# EAGLE board EDCPSUMK1-RP2040-USBC (EAGLE 9.6.2), part 1 of 2
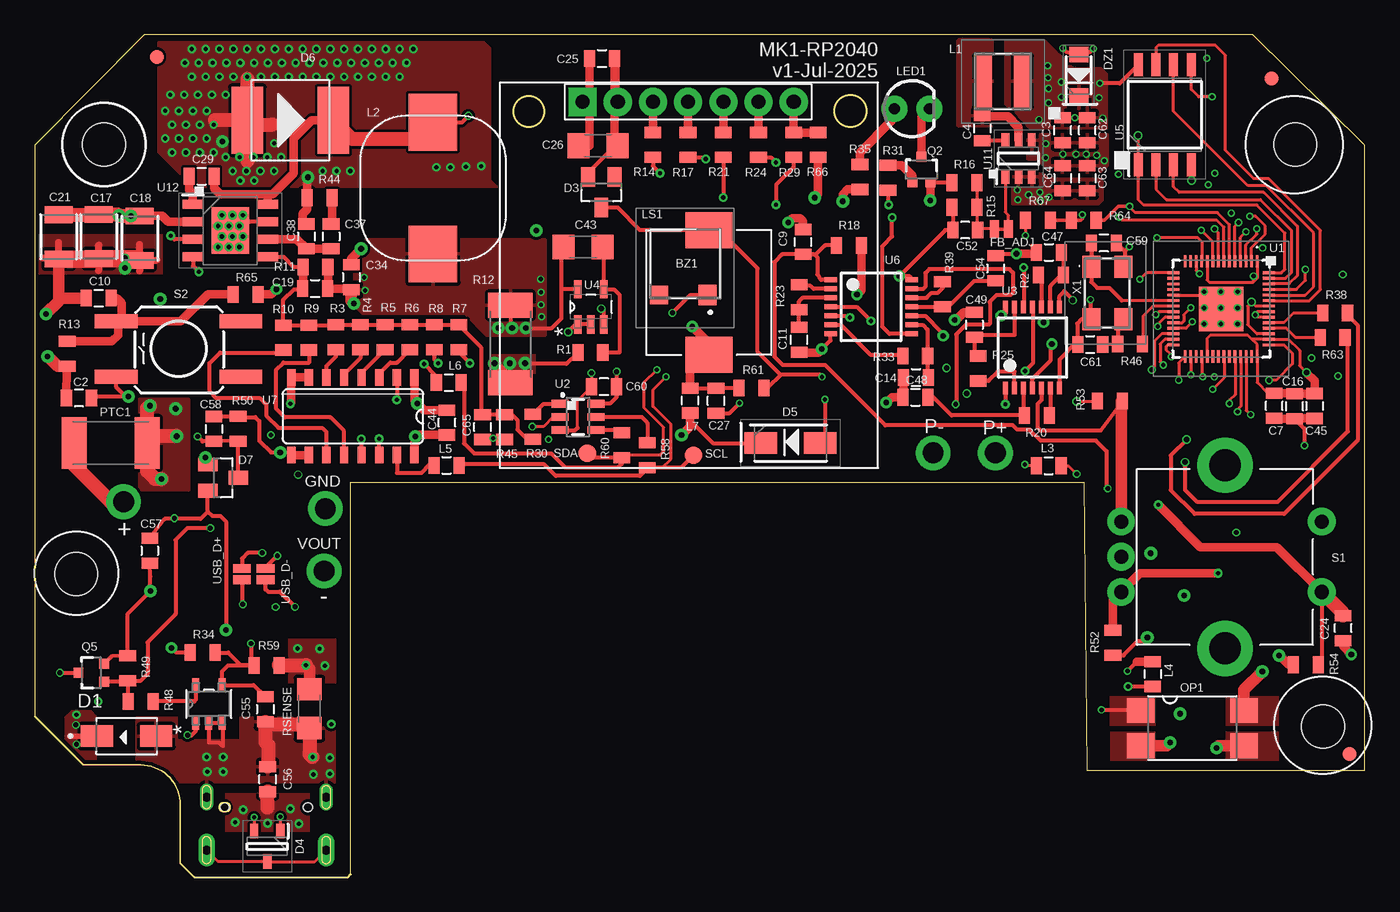
[diagram p2: board, top side]
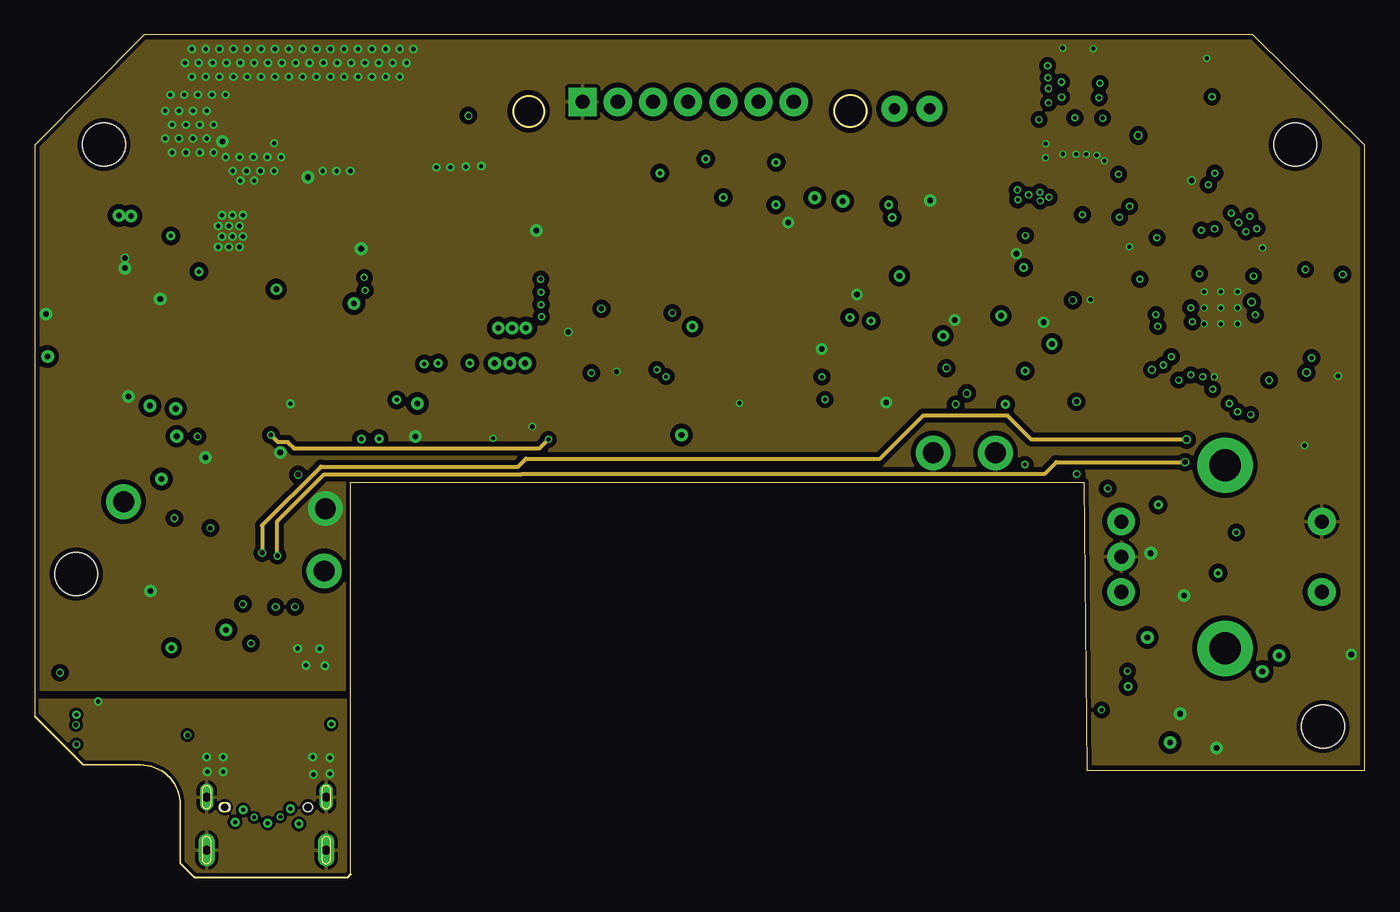
[diagram p3: board, inner layer GND]
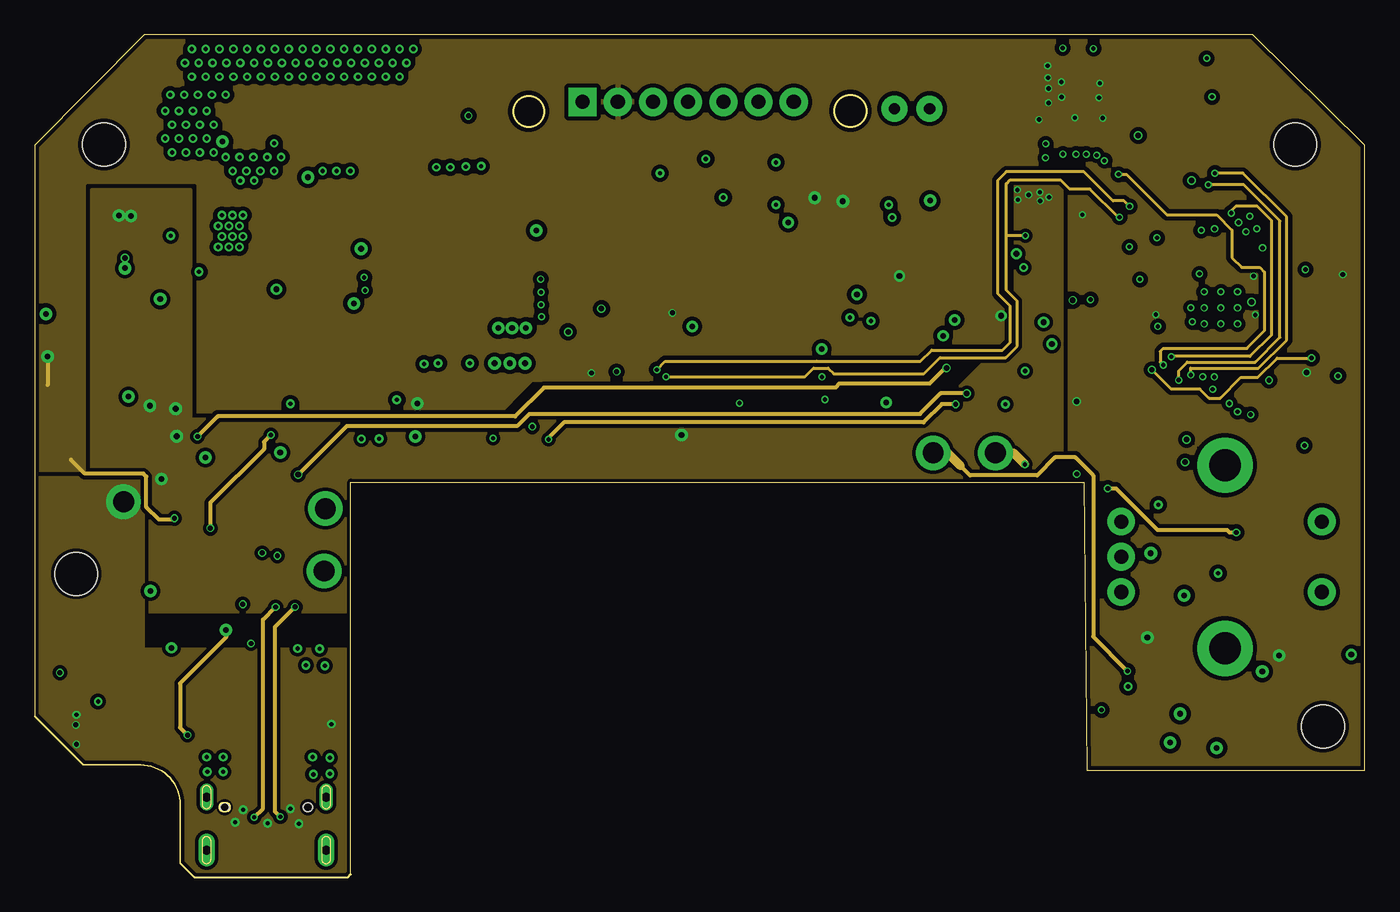
[diagram p4: board, inner layer PWR]
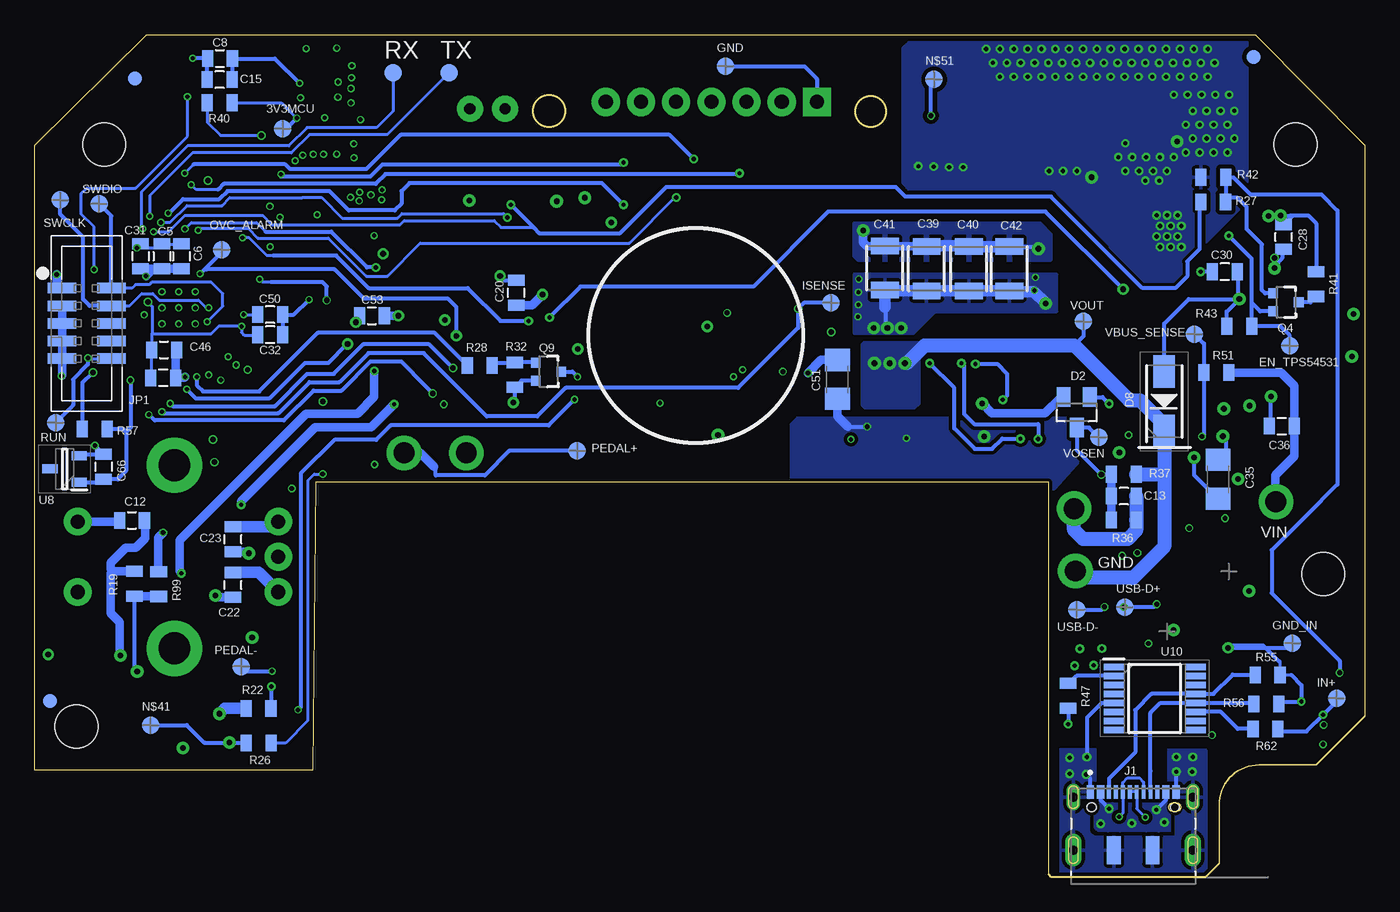
[diagram p5: board, bottom side, seen from below]

Size 96 x 60.8 mm. Coordinates in mm from the lower left corner, seen from the top.
Outline: 96,7.7 96,52.8 87.9,60.8 7.9,60.8 0,52.8 0,11.6 3.5,8.1 7.62,8.1 arc-90 10.5,5.22 10.5,1 11.5,0 22.6,0 22.8,0.2 22.8,28.5 75.71,28.5 75.92,7.7 96,7.7
Outline: circle at 35.64,55.26 radius 1.09
Outline: circle at 58.87,55.29 radius 1.14
Copper layers (1*2*15*16): Top 0.035mm / dielectric 0.2mm / GND 0.0175mm / dielectric 0.3mm / PWR 0.0175mm / dielectric 0.2mm / Bottom 0.035mm
Design rules "SeeedStudio_4layer_DRU_no_angle_20140221 *": minimum track width 8mil, minimum drill 12mil, track to track 8mil, track to pad 8mil, pad to pad 8mil, via to via 8mil, smd to smd 0mil, copper to edge 10mil, drill to drill 8mil, minimum pad ring 6mil, minimum via ring 4mil, stop-mask expansion 4mil, vias tented up to drill 25mil, thermal gap 10mil
Net classes: 1 vcc: width 0.254 mm
Holes 3.1 mm at 4.98,52.88 90.98,52.88 2.98,21.88 92.98,10.88
tRestrict: area 0.4,19.3 to 5.4,24.3; area 2.5,50.4 to 7.5,55.4; area 88.5,50.4 to 93.5,55.4; area 90.5,8.4 to 95.5,13.4
bRestrict: area 90.5,8.4 to 95.5,13.4; area 88.5,50.4 to 93.5,55.4; area 2.5,50.4 to 7.5,55.4; area 0.4,19.4 to 5.4,24.4

## Footprints (pad centres in the part's own frame; a part is rotated, then mirrored left to right if it is on the bottom)
TESTPAD_B1,27 = smd 1.27 x 1.27: TP 0,0
PKMCS0909 = smd 2.6 x 3.4: 1 -4.5,0; 2 4.5,0
0805 = smd 0.8 x 1.2: 1 -0.9,0; 2 0.9,0
1210 = smd 1.2 x 2: 1 -1.6,0; 2 1.6,0
1206 = smd 1.6 x 1.8: 1 -1.4,0; 2 1.4,0
DIOM4325X244N = smd 2.33 x 1.55: A 2.135,0; C -2.135,0
SOT23 = smd 1 x 1.4: 1 -0.95,-1.1; 2 0.95,-1.1; 3 0,1.1
SOT95P230X110-3N = smd 1.05 x 0.6: 1 -1.1,0.95; 2 -1.1,-0.95; 3 1.1,0
DIOM5226X244N = smd 2.35 x 1.55: 1 -2.15,0; 2 2.15,0
DO-214AB = smd 2.286 x 4.8: 1 -3.1,0; 2 3.1,0
SODFL3518X115N = smd 1.12 x 1.37: 1 -1.5,0; 2 1.5,0
SMT-JUMPER_2_NC_TRACE_NO-SILK = smd 0.635 x 1.27: 1 -0.508,0; 2 0.508,0
FIDUCIAL-1X2 = smd 1 x 1: 1 0,0
JAE_DX07S016JA1R1500 = smd 0.52 x 1: 1 -3.1,1.1; 2 -2.35,1.1; 11 2.35,1.1; 12 3.1,1.1 | smd 0.27 x 1: 3 -1.75,1.1; 4 -1.25,1.1; 5 -0.75,1.1; 6 -0.25,1.1; 7 0.25,1.1; 8 0.75,1.1; 9 1.25,1.1; 10 1.75,1.1 | smd 1 x 2: S1 -1.4,-3.1; S2 1.4,-3.1 | drill 0.65 long: S3 -4.32,0.725; S4 4.32,0.725 | drill 0.65 pad 1.2 long: S5 -4.32,-3.1; S6 4.32,-3.1 | hole 0.6: 3,0 | hole 0.63: 3,0; -3,0
OLED_LCD = drill 1.016 pad 2.032 square: 1 -7.42,13.7 | drill 1.016 pad 2.032: 2 -4.88,13.7; 3 -2.34,13.7; 4 0.2,13.7; 5 2.74,13.7; 6 5.28,13.7; 7 7.82,13.7
20021521-00010T1LF = smd 0.76 x 2.05: 1 -2.54,-1.78; 2 -2.54,1.78; 3 -1.27,-1.78; 4 -1.27,1.78; 5 0,-1.78; 6 0,1.78; 7 1.27,-1.78; 8 1.27,1.78; 9 2.54,-1.78; 10 2.54,1.78
NRS4018T100MDGJ = smd 1.2 x 3.7: 1 -1.4,0; 2 1.4,0
WE-LHMI = smd 4.1 x 3.5: 1 -4.75,0; 2 4.75,0
LED3MM = drill 0.813 pad 1.88: A -1.27,0; K 1.27,0
SMT0540SR = smd 1.5 x 1.3: 1 -2.25,-1.6; 2 2.25,-1.6 | smd 1.3 x 1.3: 3 -2.25,1.9
SMD4 = smd 1.78 x 2: 1 -1.27,-3.725; 2 1.27,-3.725; 3 1.27,3.725; 4 -1.27,3.725
1812L = smd 1.8 x 3.7: 1 -2.6,0; 2 2.65,0
SOT323 = smd 0.7 x 0.7: 1 -0.65,-0.925; 2 0.65,-0.925; 3 0,0.925
R2512 = smd 1.8 x 3.2: 1 -2.8,0; 2 2.8,0
ROTARY_ENC_PLAIN = drill 1.016 pad 2: A 7.493,-2.54; B 7.493,2.54; C 7.493,0; SW+ -6.985,2.54; SW- -6.985,-2.54 | drill 2.286 pad 4: P$3 0,6.604; P$4 0,-6.604
TAC_SW_SMD_KSC931G = smd 3.1 x 1: 1 -4.5,2; 2 4.5,2; 3 -4.5,-2; 4 4.5,-2
RP2040TR7 = smd 0.875 x 0.2: 1 -3.438,2.6; 2 -3.438,2.2; 3 -3.438,1.8; 4 -3.438,1.4; 5 -3.438,1; 6 -3.438,0.6; 7 -3.438,0.2; 8 -3.438,-0.2; 9 -3.438,-0.6; 10 -3.438,-1; 11 -3.438,-1.4; 12 -3.438,-1.8; 13 -3.438,-2.2; 14 -3.438,-2.6; 29 3.438,-2.6; 30 3.438,-2.2; 31 3.438,-1.8; 32 3.438,-1.4; 33 3.438,-1; 34 3.438,-0.6; 35 3.438,-0.2; 36 3.438,0.2; 37 3.438,0.6; 38 3.438,1; 39 3.438,1.4; 40 3.438,1.8; 41 3.438,2.2; 42 3.438,2.6 | smd 0.2 x 0.875: 15 -2.6,-3.438; 16 -2.2,-3.438; 17 -1.8,-3.438; 18 -1.4,-3.438; 19 -1,-3.438; 20 -0.6,-3.438; 21 -0.2,-3.438; 22 0.2,-3.438; 23 0.6,-3.438; 24 1,-3.438; 25 1.4,-3.438; 26 1.8,-3.438; 27 2.2,-3.438; 28 2.6,-3.438; 43 2.6,3.438; 44 2.2,3.438; 45 1.8,3.438; 46 1.4,3.438; 47 1,3.438; 48 0.6,3.438; 49 0.2,3.438; 50 -0.2,3.438; 51 -0.6,3.438; 52 -1,3.438; 53 -1.4,3.438; 54 -1.8,3.438; 55 -2.2,3.438; 56 -2.6,3.438 | smd 3.2 x 3.2: 57 0,0
SOT23-6 = smd 0.55 x 1.2: 1 0.95,1.3; 2 0,1.3; 3 -0.95,1.3; 4 -0.95,-1.3; 5 0,-1.3; 6 0.95,-1.3
TSSOP14 = smd 0.35 x 0.9: 1 -1.95,-2.925; 2 -1.3,-2.925; 3 -0.65,-2.925; 4 0,-2.925; 5 0.65,-2.925; 6 1.3,-2.925; 7 1.95,-2.925; 8 1.95,2.925; 9 1.3,2.925; 10 0.65,2.925; 11 0,2.925; 12 -0.65,2.925; 13 -1.3,2.925; 14 -1.95,2.925
SOT95P280X145-5N = smd 1.321 x 0.559: 1 -1.27,0.94; 2 -1.27,0; 3 -1.27,-0.94; 4 1.27,-0.94; 5 1.27,0.94
SOIC127P790X216-8N = smd 1.65 x 0.65: 1 -3.6,1.905; 2 -3.6,0.635; 3 -3.6,-0.635; 4 -3.6,-1.905; 5 3.6,-1.905; 6 3.6,-0.635; 7 3.6,0.635; 8 3.6,1.905
SO16 = smd 0.6 x 1.2: 1 -4.445,-2.8; 2 -3.175,-2.8; 3 -1.905,-2.8; 4 -0.635,-2.8; 5 0.635,-2.8; 6 1.905,-2.8; 7 3.175,-2.8; 8 4.445,-2.8; 9 4.445,2.8; 10 3.175,2.8; 11 1.905,2.8; 12 0.635,2.8; 13 -0.635,2.8; 14 -1.905,2.8; 15 -3.175,2.8; 16 -4.445,2.8
SOT96P240X120-3N = smd 1.1 x 0.65: 1 -1.05,0.96; 2 -1.05,-0.96; 3 1.05,0
21-0057F_MXM = smd 0.978 x 0.508: 1 -1.365,0.95; 2 -1.365,0; 3 -1.365,-0.95; 4 1.365,-0.95; 5 1.365,0.95
SOP65P640X120-16N = smd 1.475 x 0.45: 1 -2.938,2.275; 2 -2.938,1.625; 3 -2.938,0.975; 4 -2.938,0.325; 5 -2.938,-0.325; 6 -2.938,-0.975; 7 -2.938,-1.625; 8 -2.938,-2.275; 9 2.938,-2.275; 10 2.938,-1.625; 11 2.938,-0.975; 12 2.938,-0.325; 13 2.938,0.325; 14 2.938,0.975; 15 2.938,1.625; 16 2.938,2.275
SOT95P280X100-6N = smd 1.05 x 0.55: 1 -1.3,0.95; 2 -1.3,0; 3 -1.3,-0.95; 4 1.3,-0.95; 5 1.3,0; 6 1.3,0.95
SOIC127P600X163-9N = smd 1.5 x 0.65: 1 -2.7,1.905; 2 -2.7,0.635; 3 -2.7,-0.635; 4 -2.7,-1.905; 5 2.7,-1.905; 6 2.7,-0.635; 7 2.7,0.635; 8 2.7,1.905 | smd 2.71 x 3.35: 9 0,0
SMT-JUMPER_2_NO_NO-SILK = smd 0.635 x 1.27: 1 -0.406,0; 2 0.406,0
ABM3C16000MHZD4YT = smd 1.6 x 1.3: 1 -1.9,-1.15; 2 1.9,-1.15; 3 1.9,1.15; 4 -1.9,1.15

## Placement (x,y rotation side)
3V3MCU  TESTPAD_TPSQB1,27  [TESTPAD_B1,27]  78.11,54.02 0 bottom
BZ1  PKMCS0909E4000-R1  [PKMCS0909]  48.64,42.2 90 top
C2  100n 50v X7R/X5R  [0805]  3.18,34.58 180 top
C3  22uF 10V X5R  [0805]  74.18,53.9 90 top
C4  100n 50v X7R/X5R  [0805]  68.38,54.03 270 top
C5  100n 50v X7R/X5R  [0805]  86.81,44.8 270 bottom
C6  100n 50v X7R/X5R  [0805]  85.4,44.8 270 bottom
C7  100n 50v X7R/X5R  [0805]  89.45,34.01 90 top
C8  100n 50v X7R/X5R  [0805]  82.62,59.08 0 bottom
C9  1uF 50V X7R  [0805]  55.45,45.84 90 top
C10  100n 50v X7R/X5R  [0805]  4.61,41.78 0 top
C11  1uF 50V X7R  [0805]  55.16,38.79 90 top
C12  100n 50v X7R/X5R  [0805]  88.97,25.75 0 bottom
C13  1uF 50V X7R  [0805]  17.38,27.5 180 bottom
C14  100n 50v X7R/X5R  [0805]  63.6,36.06 0 top
C15  1uF 50V X7R  [0805]  82.65,57.55 180 bottom
C16  100n 50v X7R/X5R  [0805]  90.92,33.99 90 top
C17  4.7uF 50V X7R  [1210]  4.6,46.23 270 top
C18  4.7uF 50V X7R  [1210]  7.56,46.11 270 top
C19  N.C.  [0805]  20.22,42.47 0 top
C20  100n 50v X7R/X5R  [0805]  61.23,42.17 90 bottom
C21  4.7uF 50V X7R  [1210]  1.71,46.2 270 top
C22  100n 50v X7R/X5R  [0805]  81.69,21.09 90 bottom
C23  100n 50v X7R/X5R  [0805]  81.69,24.39 90 bottom
C24  100n 50v X7R/X5R  [0805]  94.44,17.98 90 top
C25  100n 50v X7R/X5R  [0805]  40.93,59.08 0 top
C26  10uF 50V X5R/X7R  [1206]  40.64,52.79 180 top
C27  100n 50v X7R/X5R  [0805]  49.16,34.38 90 top
C28  100n 50v X7R/X5R  [0805]  5.84,46.2 90 bottom
C29  100n 50v X7R/X5R  [0805]  12.03,50.58 0 top
C30  33n  [0805]  10.08,43.69 180 bottom
C31  100n 50v X7R/X5R  [0805]  88.35,44.8 270 bottom
C32  100n 50v X7R/X5R  [0805]  78.99,39.14 180 bottom
C33  100n 50v X7R/X5R  [0805]  86.73,36.03 180 bottom
C34  100n 50v X7R/X5R  [0805]  22.84,43.29 270 top
C35  10uF 50V X5R/X7R  [1206]  10.57,28.71 270 bottom
C36  100n 50v X7R/X5R  [0805]  5.98,32.55 0 bottom
C37  10nF  [0805]  21.38,46.23 270 top
C38  16pF  [0805]  19.59,46.23 270 top
C39  22uF 25V X5R  [1210]  31.61,43.91 90 bottom
C40  22uF 25V X5R  [1210]  28.56,43.91 90 bottom
C41  22uF 25V X5R  [1210]  34.62,43.96 90 bottom
C42  22uF 25V X5R  [1210]  25.64,43.91 90 bottom
C43  10uF 50V X5R/X7R  [1206]  39.56,45.47 0 top
C44  100n 50v X7R/X5R  [0805]  29.75,32.81 90 top
C45  1uF 50V X7R  [0805]  92.37,34 270 top
C46  1uF 50V X7R  [0805]  86.66,38.05 0 bottom
C47  100n 50v X7R/X5R  [0805]  73.2,45.09 0 top
C48  100n 50v X7R/X5R  [0805]  63.56,34.63 0 top
C49  100n 50v X7R/X5R  [0805]  67.82,39.86 270 top
C50  100n 50v X7R/X5R  [0805]  79.01,40.59 180 bottom
C51  10uF 50V X5R/X7R  [1206]  38.06,35.92 90 bottom
C52  N.C  [0805]  67.15,46.69 180 top
C53  100n 50v X7R/X5R  [0805]  71.65,40.52 0 bottom
C54  1uF 50V X7R  [0805]  69.35,43.93 270 top
C55  100n 50v X7R/X5R  [0805]  16.63,12.11 270 top
C56  1uF 50V X7R  [0805]  16.8,7.07 90 top
C57  100n 50v X7R/X5R  [0805]  8.29,23.55 270 top
C58  100n 50v X7R/X5R  [0805]  12.93,32.34 270 top
C59  27p  [0805]  77.16,45.76 180 top
C60  100n 50v X7R/X5R  [0805]  41.07,35.39 180 top
C61  27p  [0805]  76.17,38.44 0 top
C62  22uF 10V X5R  [0805]  75.96,53.9 90 top
C63  4.7uF 50V X5R  [0805]  75.96,50.43 270 top
C64  4.7uF 50V X5R  [0805]  74.18,50.44 270 top
C65  N.C.  [0805]  32.31,32.48 90 top
C66  100n 50v X7R/X5R  [0805]  91.02,29.61 270 bottom
D1  SMAJ24A  [DIOM4325X244N]  6.62,10.18 0 top
D2  BAV199  [SOT23]  20.77,33.54 180 bottom
D3  N.C  [SOT23]  40.88,49.43 180 top
D4  PESD5V0U2BT,215  [SOT95P230X110-3N]  16.77,2.22 270 top
D5  3SMAJ5923B-TP  [DIOM5226X244N]  54.54,31.32 0 top
D6  N.C  [DO-214AB]  18.43,54.62 0 top
D7  BAV199  [SOT23]  13.59,28.83 270 top
D8  RB060M-60TR  [DIOM5226X244N]  14.46,34.33 90 bottom
DZ1  MMSZ5228B-7-F  [SODFL3518X115N]  75.34,57.86 90 top
EN_TPS54531  TESTPAD_TPSQB1,27  [TESTPAD_B1,27]  5.41,38.35 0 bottom
FB_ADJ  JUMPER-SMT_2_NC_TRACE_NO-SILK  [SMT-JUMPER_2_NC_TRACE_NO-SILK]  69.77,46.77 0 top
FID1  FIDUCIAL1X2  [FIDUCIAL-1X2]  89.27,57.64 0 top
FID2  FIDUCIAL1X2  [FIDUCIAL-1X2]  94.9,8.89 0 top
FID3  FIDUCIAL1X2  [FIDUCIAL-1X2]  8.03,59.19 0 bottom
FID4  FIDUCIAL1X2  [FIDUCIAL-1X2]  8.79,59.19 0 top
FID5  FIDUCIAL1X2  [FIDUCIAL-1X2]  88.76,57.64 0 bottom
FID6  FIDUCIAL1X2  [FIDUCIAL-1X2]  94.9,12.7 0 bottom
GND  TESTPAD_TPSQB1,27  [TESTPAD_B1,27]  46.12,58.5 0 bottom
GND_IN  TESTPAD_TPSQB1,27  [TESTPAD_B1,27]  5.21,16.89 0 bottom
IN+  TESTPAD_TPSQB1,27  [TESTPAD_B1,27]  2.02,12.91 0 bottom
ISENSE  TESTPAD_TPSQB1,27  [TESTPAD_B1,27]  38.53,41.44 0 bottom
J1  DX07S016JA1R1500  [JAE_DX07S016JA1R1500]  16.7,5.05 0 bottom
J6  Display  [OLED_LCD]  46.95,42.24 0 top
JP1  20021521-00010T1LF  [20021521-00010T1LF]  92.24,39.96 270 bottom
L1  NRS4018T4R7MDGJ  [NRS4018T100MDGJ]  69.87,57.42 0 top
L2  4.7uH  [WE-LHMI]  28.73,49.72 270 top
L3  MMZ2012Y202BT000  [0805]  73.18,29.69 0 top
L4  MMZ2012Y202BT000  [0805]  80.69,14.66 270 top
L5  MMZ2012Y202BT000  [0805]  29.7,29.71 0 top
L6  MMZ2012Y202BT000  [0805]  29.87,35.69 0 top
L7  MMZ2012Y202BT000  [0805]  47.3,34.4 90 top
LED1  [LED3MM]  63.31,55.45 0 top
LS1  SMT-0540-S-R  [SMT0540SR]  46.95,44.26 90 top
N$41  TESTPAD_TPSQB1,27  [TESTPAD_B1,27]  87.63,10.97 0 bottom
N$51  TESTPAD_TPSQB1,27  [TESTPAD_B1,27]  31.07,57.57 0 bottom
OP1  LTV816S  [SMD4]  83.54,10.76 270 top
OVC_ALARM  TESTPAD_TPSQB1,27  [TESTPAD_B1,27]  82.5,45.28 0 bottom
PEDAL+  TESTPAD_TPSQB1,27  [TESTPAD_B1,27]  56.83,30.76 0 bottom
PEDAL-  TESTPAD_TPSQB1,27  [TESTPAD_B1,27]  81.08,15.2 0 bottom
PTC1  2A NOM / 3.5A LIM  [1812L]  5.49,31.32 180 top
Q2  2N7002PW  [SOT323]  63.98,51.06 0 top
Q4  2N7002PW  [SOT323]  5.67,41.49 270 bottom
Q5  2N7002PW  [SOT323]  4.07,14.75 90 top
Q9  2N7002PW  [SOT323]  58.91,36.48 270 bottom
R1  10K  [0805]  40.09,37.86 180 top
R2  1K  [0805]  73.34,43.45 0 top
R3  11K  [0805]  21.72,38.95 90 top
R4  5K6  [0805]  23.49,38.95 90 top
R5  2K8  [0805]  25.27,38.95 90 top
R6  1K4  [0805]  27.05,38.95 90 top
R7  180K  [0805]  30.61,38.95 90 top
R8  91K  [0805]  28.83,38.95 90 top
R9  43K  [0805]  19.79,38.94 90 top
R10  22K  [0805]  17.93,38.94 90 top
R11  15K  [0805]  20.25,44.02 0 top
R12  0.025R / 1W  [R2512]  34.32,38.47 270 top
R13  2K2  [0805]  2.33,37.77 270 top
R14  33R  [0805]  44.6,52.84 90 top
R15  0R  [0805]  67.08,48.34 0 top
R16  N.C  [0805]  67.08,50.11 180 top
R17  33R  [0805]  47.14,52.84 90 top
R18  N.C  [0805]  58.75,45.58 180 top
R19  1k  [0805]  88.8,21.17 90 bottom
R20  1K  [0805]  72.33,33.32 180 top
R21  33R  [0805]  49.68,52.84 90 top
R22  330R  [0805]  79.84,12.17 180 bottom
R23  2K2  [0805]  55.16,41.84 270 top
R24  33R  [0805]  52.22,52.84 90 top
R25  1K  [0805]  68.1,36.71 90 top
R26  330R  [0805]  79.83,9.68 180 bottom
R27  1K  [0805]  10.93,48.72 180 bottom
R28  33R  [0805]  63.87,36.93 0 bottom
R29  33R  [0805]  54.76,52.84 90 top
R30  N.C  [0805]  35.95,32.51 270 top
R31  330R  [0805]  61.57,50.46 90 top
R32  10K  [0805]  61.34,36.24 270 bottom
R33  330R  [0805]  63.54,37.61 0 top
R34  N.C  [0805]  12.1,16.2 0 top
R35  130R  [0805]  59.55,50.52 90 top
R36  27K  [0805]  17.38,25.78 0 bottom
R37  150K  [0805]  17.38,29.07 180 bottom
R38  27R  [0805]  93.85,40.7 180 top
R39  10K  [0805]  65.51,42.05 270 top
R40  10K  [0805]  82.63,55.88 0 bottom
R41  150K  [0805]  3.49,42.8 90 bottom
R42  10K  [0805]  10.92,50.5 0 bottom
R43  11K  [0805]  9.04,39.76 0 bottom
R44  25K  [0805]  20.54,49.03 0 top
R45  N.C  [0805]  33.9,32.48 90 top
R46  1K  [0805]  79.05,38.47 180 top
R47  100R  [0805]  21.39,13.09 90 bottom
R48  100R  [0805]  7.63,12.68 180 top
R49  10K  [0805]  6.7,15.08 270 top
R50  56K  [0805]  14.66,32.36 90 top
R51  390K  [0805]  10.69,36.41 180 bottom
R52  2K2  [0805]  77.81,16.9 270 top
R53  2K2  [0805]  77.59,34.35 180 top
R54  2K2  [0805]  91.73,15.33 180 top
R55  5K1  [0805]  7,14.6 180 bottom
R56  5K1  [0805]  7.1,12.5 180 bottom
R57  330R  [0805]  91.65,32.35 180 bottom
R58  N.C  [0805]  44.21,30.45 90 top
R59  1K  [0805]  16.73,15.29 180 top
R60  N.C  [0805]  42.35,31.16 90 top
R61  330R  [0805]  51.73,35.3 180 top
R62  100K  [0805]  7.15,10.7 0 bottom
R63  27R  [0805]  93.67,38.94 180 top
R64  2K2  [0805]  75.7,47.4 180 top
R65  33R  [0805]  15.22,42.05 180 top
R66  10K  [0805]  56.53,52.84 90 top
R67  2K2  [0805]  72.4,47.4 0 top
R99  330R  [0805]  87.05,21.15 90 bottom
RSENSE  100mR  [1206]  19.81,12.16 90 top
RUN  TESTPAD_TPSQB1,27  [TESTPAD_B1,27]  94.48,32.8 0 bottom
RX  TESTPAD_TPSQB1,27  [TESTPAD_B1,27]  70.12,58.05 0 bottom
S1  ROTARTY_ENCODER  [ROTARY_ENC_PLAIN]  85.9,23.12 180 top
S2  [TAC_SW_SMD_KSC931G]  10.37,38.1 180 top
SCL  TESTPAD_TPSQB1,27  [TESTPAD_B1,27]  47.55,30.46 0 top
SDA  TESTPAD_TPSQB1,27  [TESTPAD_B1,27]  39.87,30.58 0 top
SWCLK  TESTPAD_TPSQB1,27  [TESTPAD_B1,27]  94.14,48.89 0 bottom
SWDIO  TESTPAD_TPSQB1,27  [TESTPAD_B1,27]  91.35,48.6 0 bottom
TX  TESTPAD_TPSQB1,27  [TESTPAD_B1,27]  66.08,58.05 0 bottom
U1  RP2040TR7  [RP2040TR7]  85.62,41.01 270 top
U2  MCP4725  [SOT23-6]  39.2,33.21 90 top
U3  SN74AC14PWR  [TSSOP14]  72.01,38.22 0 top
U4  MAX9938FEUK+T  [SOT95P280X145-5N]  40.13,41.15 90 top
U5  W25Q64JVSSIQ  [SOIC127P790X216-8N]  81.55,55.02 90 top
U6  SN74AC14PWR  [TSSOP14]  60.35,41.15 270 top
U7  TPIC2810D  [SO16]  22.95,33.26 180 top
U8  LM4040C30FTA  [SOT96P240X120-3N]  93.84,29.46 180 bottom
U9  MAX9064EUK+T  [21-0057F_MXM]  12.55,12.5 90 top
U10  IP2721  [SOP65P640X120-16N]  15.15,12.9 0 bottom
U11  AP63203  [SOT95P280X100-6N]  71,51.86 90 top
U12  AP64501SP-13  [SOIC127P600X163-9N]  14.1,46.66 0 top
USB-D+  TESTPAD_TPSQB1,27  [TESTPAD_B1,27]  17.31,19.48 0 bottom
USB-D-  TESTPAD_TPSQB1,27  [TESTPAD_B1,27]  20.78,19.31 0 bottom
USB_D+  JUMPER-SMT_2_NO_NO-SILK  [SMT-JUMPER_2_NO_NO-SILK]  14.95,21.88 270 top
USB_D-  JUMPER-SMT_2_NO_NO-SILK  [SMT-JUMPER_2_NO_NO-SILK]  16.65,21.88 270 top
VBUS_SENSE  TESTPAD_TPSQB1,27  [TESTPAD_B1,27]  12.27,39.19 0 bottom
VOSEN  TESTPAD_TPSQB1,27  [TESTPAD_B1,27]  19.19,31.75 0 bottom
VOUT  TESTPAD_TPSQB1,27  [TESTPAD_B1,27]  20.29,40.1 0 bottom
X1  ABM3C-12.000MHZ-D4Y-T  [ABM3C16000MHZD4YT]  77.4,42.16 270 top